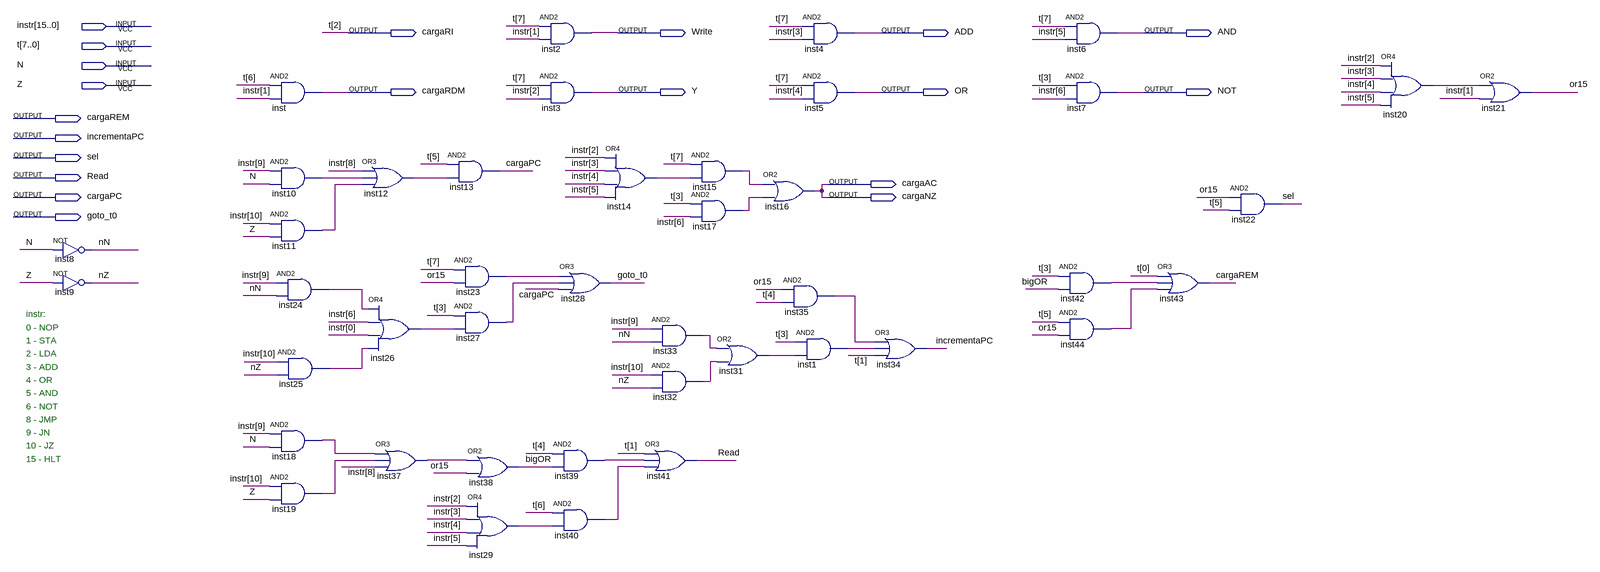
[diagram p0: schematic sheet]
// Quartus schematic unidade_controle.bdf as structural Verilog: 43 symbols, 20 pins
module unidade_controle (
  input  [15:0] instr,
  input  [7:0] t,
  input  N,
  input  Z,
  output cargaRI,
  output Write,
  output ADD,
  output AND,
  output cargaRDM,
  output Y,
  output OR,
  output NOT,
  output cargaREM,
  output incrementaPC,
  output sel,
  output Read,
  output cargaAC,
  output cargaPC,
  output cargaNZ,
  output goto_t0
);

  wire bigOR, inst1_out, inst10_out, inst11_out, inst12_out, inst14_out, inst15_out, inst17_out, inst18_out,
       inst19_out, inst20_out, inst23_out, inst24_out, inst25_out, inst26_out, inst27_out, inst29_out,
       inst31_out, inst32_out, inst33_out, inst35_out, inst37_out, inst39_out, inst40_out, inst42_out,
       inst44_out, nN, nZ, or15;

  not inst8 (nN, N);
  not inst9 (nZ, Z);
  and inst (cargaRDM, t[6], instr[1]);
  and inst10 (inst10_out, instr[9], N);
  and inst11 (inst11_out, instr[10], Z);
  and inst24 (inst24_out, instr[9], nN);
  and inst25 (inst25_out, instr[10], nZ);
  and inst18 (inst18_out, instr[9], N);
  and inst19 (inst19_out, instr[10], Z);
  or inst12 (inst12_out, instr[8], inst10_out, inst11_out);
  or inst26 (inst26_out, inst24_out, instr[6], instr[0], inst25_out);
  or inst37 (inst37_out, inst18_out, inst19_out, instr[8]);
  and inst13 (cargaPC, t[5], inst12_out);
  and inst23 (inst23_out, t[7], or15);
  and inst27 (inst27_out, t[3], inst26_out);
  or inst38 (bigOR, inst37_out, or15);
  or inst29 (inst29_out, instr[2], instr[3], instr[4], instr[5]);
  and inst2 (Write, t[7], instr[1]);
  and inst3 (Y, t[7], instr[2]);
  or inst28 (goto_t0, inst23_out, inst27_out, cargaPC);
  and inst39 (inst39_out, t[4], bigOR);
  and inst40 (inst40_out, t[6], inst29_out);
  or inst14 (inst14_out, instr[2], instr[3], instr[4], instr[5]);
  and inst33 (inst33_out, instr[9], nN);
  and inst32 (inst32_out, instr[10], nZ);
  or inst41 (Read, t[1], inst39_out, inst40_out);
  and inst15 (inst15_out, t[7], inst14_out);
  and inst17 (inst17_out, t[3], instr[6]);
  or inst31 (inst31_out, inst33_out, inst32_out);
  and inst4 (ADD, t[7], instr[3]);
  and inst5 (OR, t[7], instr[4]);
  or inst16 (cargaAC, inst15_out, inst17_out);
  and inst35 (inst35_out, or15, t[4]);
  and inst1 (inst1_out, t[3], inst31_out);
  or inst34 (incrementaPC, inst35_out, inst1_out, t[1]);
  and inst6 (AND, t[7], instr[5]);
  and inst7 (NOT, t[3], instr[6]);
  and inst42 (inst42_out, t[3], bigOR);
  and inst44 (inst44_out, t[5], or15);
  or inst43 (cargaREM, t[0], inst42_out, inst44_out);
  and inst22 (sel, or15, t[5]);
  or inst20 (inst20_out, instr[2], instr[3], instr[4], instr[5]);
  or inst21 (or15, inst20_out, instr[1]);

  assign cargaNZ = cargaAC;
  assign cargaRI = t[2];

  // Notes on the sheet:
  //   instr:
  //   0 - NOP
  //   1 - STA
  //   2 - LDA
  //   3 - ADD
  //   4 - OR
  //   5 - AND
  //   6 - NOT
  //   8 - JMP
  //   9 - JN
  //   10 - JZ
  //   15 - HLT
endmodule
